# EasyEDA schematic esp32 module.json
TITLE: ESP32 Module RGB Moon Light; REV: 1.0; Date: 2020-07-03; Sheet: 1/1; Company: RATEX
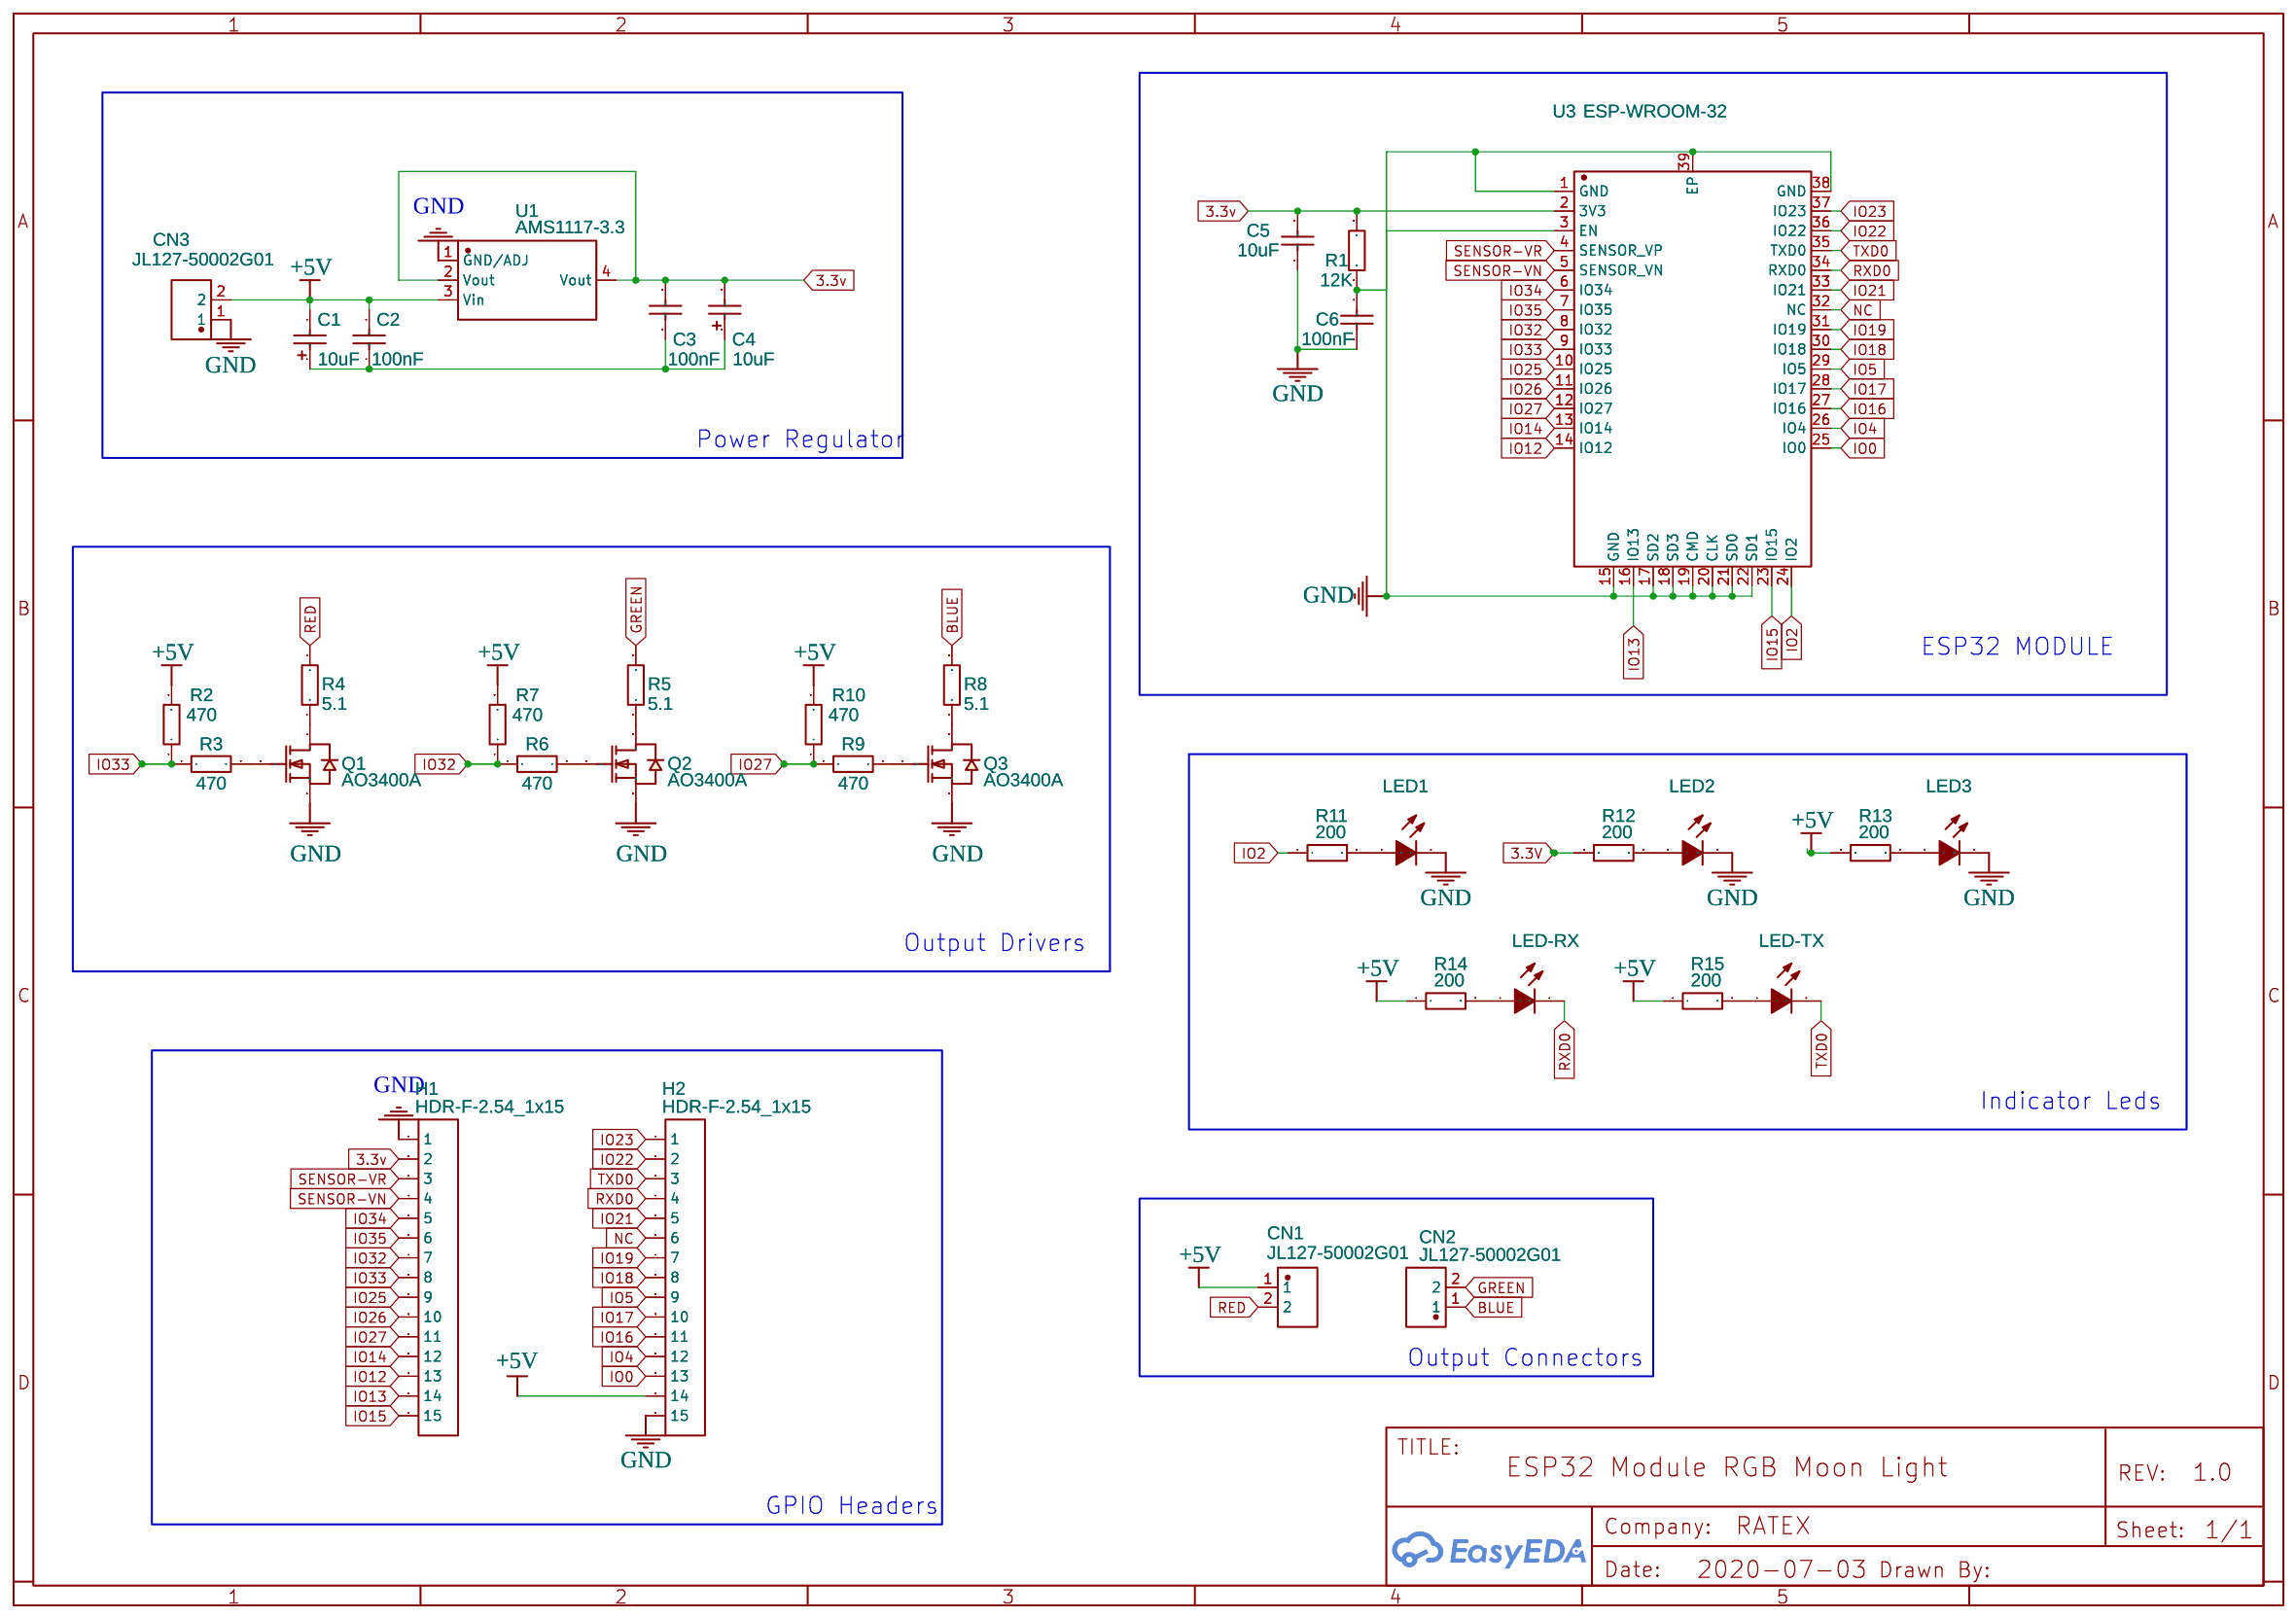
[diagram p0: schematic sheet]

## Parts
C1  10uF  [CAP-SMD_L3.2-W1.6-R-RD]
C2  100nF  [C0402]
C3  100nF  [CAP-3.5*7.5*7.2]
C4  10uF  [CAP-SMD_L3.2-W1.6-R-RD]
C5  10uF  [C0402]
C6  100nF  [C0402]
CN1  JL127-50002G01  [CONN-TH_2P-P5.08_JL127-50002G01]
CN2  JL127-50002G01  [CONN-TH_2P-P5.08_JL127-50002G01]
CN3  JL127-50002G01  [CONN-TH_2P-P5.08_JL127-50002G01]
H1  HDR-F-2.54_1x15  [HDR-F-2.54_1X15]
H2  HDR-F-2.54_1x15  [HDR-F-2.54_1X15]
LED1  19-213/Y2C-CQ2R2L/3T(CY)  [LED0603-R-RD]
LED2  19-213/Y2C-CQ2R2L/3T(CY)  [LED0603-R-RD]
LED3  19-213/Y2C-CQ2R2L/3T(CY)  [LED0603-R-RD]
LED-RX  19-213/Y2C-CQ2R2L/3T(CY)  [LED0603-R-RD]
LED-TX  19-213/Y2C-CQ2R2L/3T(CY)  [LED0603-R-RD]
Q1  AO3400A  [SOT-23-3_L2.9-W1.6-P1.90-LS2.8-BR]
Q2  AO3400A  [SOT-23-3_L2.9-W1.6-P1.90-LS2.8-BR]
Q3  AO3400A  [SOT-23-3_L2.9-W1.6-P1.90-LS2.8-BR]
R1  12K  [R0402]
R2  470  [R0402]
R3  470  [R0402]
R4  5.1  [R2512]
R5  5.1  [R2512]
R6  470  [R0402]
R7  470  [R0402]
R8  5.1  [R2512]
R9  470  [R0402]
R10  470  [R0402]
R11  200  [R0402]
R12  200  [R0402]
R13  200  [R0402]
R14  200  [R0402]
R15  200  [R0402]
U1  AMS1117-3.3  [SOT-223-3_L6.5-W3.4-P2.30-LS7.0-BR]
U3  ESP-WROOM-32  [WIFIM-SMD_ESP-WROOM-32]

## Library data of the parts
C1 C4 = TAJA106K016RNJ: Supplier: LCSC; Manufacturer: AVX; LCSC Assembly: Yes; Supplier Part: C7171; SMT Type: Basic
C2 C6 = CL05B104KO5NNNC: Supplier: LCSC; Manufacturer: SAMSUNG; LCSC Assembly: Yes; Supplier Part: C1525; SMT Type: Basic
C3 = Calibration capacitor100nF（104）100V,5%: Supplier: LCSC; Manufacturer: ReliaPro; Supplier Part: C26609
C5 = CL05A106MQ5NUNC: Supplier: LCSC; Manufacturer: SAMSUNG; LCSC Assembly: Yes; Supplier Part: C15525; SMT Type: Basic
CN1-CN3 = JL127-50002G01: Supplier: LCSC; Supplier Part: C387826; Manufacturer: JILN; Contributor: LCSC
H1 H2 = HDR-F-2.54_1x15: Supplier Part: C124408; Supplier: LCSC; Contributor: LCEDA_Lib
LED1-LED3 LED-RX LED-TX = 19-213/Y2C-CQ2R2L/3T(CY): Supplier: LCSC; Manufacturer: EVERLIGHT; LCSC Assembly: Yes; image: //image.lceda.cn/szlcsc/C72038.jpg; Supplier Part: C72038; SMT Type: Basic
Q1-Q3 = AO3400A: Supplier: LCSC; Manufacturer: AOS; LCSC Assembly: Yes; image: //image.lceda.cn/szlcsc/C20917.jpg; Supplier Part: C20917; SMT Type: Basic
R1 = 0402WGF1202TCE: Supplier: LCSC; Manufacturer: UniOhm; LCSC Assembly: Yes; Supplier Part: C25752; SMT Type: Basic
R2 R3 R6 R7 R9 R10 = 0402WGF4700TCE: Supplier: LCSC; Manufacturer: UniOhm; LCSC Assembly: Yes; Supplier Part: C25117; SMT Type: Basic
R4 R5 R8 = 25121WF510KT4E: Supplier: LCSC; Supplier Part: C73113; Manufacturer: Uniroyal Elec; Contributor: LCSC; LCSC Assembly: Yes; SMT Type: Extend
R11-R15 = 0402WGF2000TCE: Supplier: LCSC; Manufacturer: UniOhm; LCSC Assembly: Yes; Supplier Part: C25087; SMT Type: Basic
U1 = AMS1117-3.3: sourceId: dwIGgezVh; Supplier: LCSC; Manufacturer: AMS; LCSC Assembly: Yes; image: //image.lceda.cn/szlcsc/C6186.jpg; Supplier Part: C6186; SMT Type: Basic
U3 = ESP-WROOM-32: Supplier: LCSC; Manufacturer: ESPRESSIF; Supplier Part: C95209

## Nets
3.3v: C1.2 C3.2 C5.2 H1.2 R1.2 U1.2(Vout) U1.4(Vout) U3.2(3V3)
3.3V: R12.1
+5V: C2.2 C4.2 CN1.1 CN3.2 H2.14 R2.2 R7.2 R10.2 R13.1 R14.1 R15.1 U1.3(Vin)
GND: C5.1 C6.1 CN3.1 H1.1 H2.15 LED1.2(C) LED2.2(C) LED3.2(C) Q1.2(S) Q2.2(S) Q3.2(S) U1.1(GND/ADJ) U3.1(GND) U3.15(GND) U3.17(SD2) U3.18(SD3) U3.19(CMD) U3.20(CLK) U3.21(SD0) U3.22(SD1) U3.38(GND) U3.39(EP)
BLUE: CN2.1 R8.2
GREEN: CN2.2 R5.2
IO0: H2.13 U3.25(IO0)
IO2: R11.1 U3.24(IO2)
IO4: H2.12 U3.26(IO4)
IO5: H2.9 U3.29(IO5)
IO12: H1.13 U3.14(IO12)
IO13: H1.14 U3.16(IO13)
IO14: H1.12 U3.13(IO14)
IO15: H1.15 U3.23(IO15)
IO16: H2.11 U3.27(IO16)
IO17: H2.10 U3.28(IO17)
IO18: H2.8 U3.30(IO18)
IO19: H2.7 U3.31(IO19)
IO21: H2.5 U3.33(IO21)
IO22: H2.2 U3.36(IO22)
IO23: H2.1 U3.37(IO23)
IO25: H1.9 U3.10(IO25)
IO26: H1.10 U3.11(IO26)
IO27: H1.11 R9.1 R10.1 U3.12(IO27)
IO32: H1.7 R6.1 R7.1 U3.8(IO32)
IO33: H1.8 R2.1 R3.1 U3.9(IO33)
IO34: H1.5 U3.6(IO34)
IO35: H1.6 U3.7(IO35)
NC: H2.6 U3.32(NC)
RED: CN1.2 R4.2
RXD0: H2.4 LED-RX.2(C) U3.34(RXD0)
SENSOR-VN: H1.4 U3.5(SENSOR_VN)
SENSOR-VR: H1.3 U3.4(SENSOR_VP)
TXD0: H2.3 LED-TX.2(C) U3.35(TXD0)
Net-(C1-1): C1.1 C2.1 C3.1 C4.1
Net-(C6-2): C6.2 R1.1 U3.3(EN)
Net-(LED1-1): LED1.1(A) R11.2
Net-(LED2-1): LED2.1(A) R12.2
Net-(LED3-1): LED3.1(A) R13.2
Net-(LED-RX-1): LED-RX.1(A) R14.2
Net-(LED-TX-1): LED-TX.1(A) R15.2
Net-(Q1-1): Q1.1(G) R3.2
Net-(Q1-3): Q1.3(D) R4.1
Net-(Q2-1): Q2.1(G) R6.2
Net-(Q2-3): Q2.3(D) R5.1
Net-(Q3-1): Q3.1(G) R9.2
Net-(Q3-3): Q3.3(D) R8.1

## Notes on the sheet
- Power Regulator
- ESP32 MODULE
- Output Drivers
- Indicator Leds
- Output Connectors
- GPIO Headers
